# Altium project TM4C123G.PrjPcb (part 1 of 2)
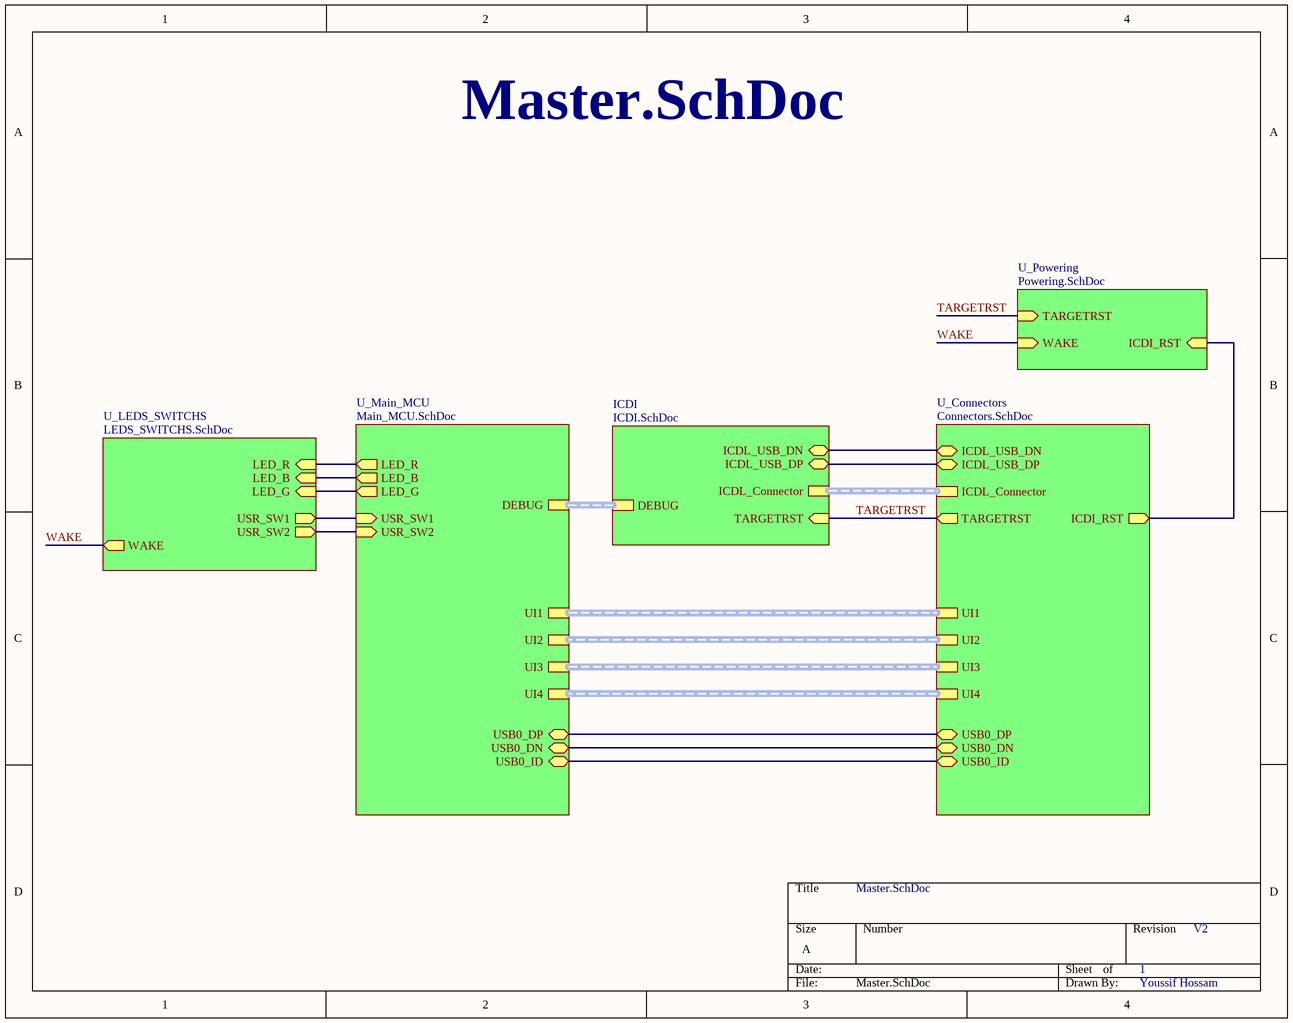
[diagram p0: Master.SchDoc]
Version: V2; Designer: Youssif Hossam
6 sheets, 93 parts. Net scope: hierarchical (ports join the sheet entries above them; power ports are global).
Board file: TM4C123G.PcbDoc
Sheets:
  Master.SchDoc
    U_Main_MCU = Main_MCU.SchDoc
    U_Connectors = Connectors.SchDoc
    ICDI = ICDI.SchDoc
    U_LEDS_SWITCHS = LEDS_SWITCHS.SchDoc
    U_Powering = Powering.SchDoc

## Sheet Master.SchDoc
size A; SheetNumber: 1; SheetTotal: 5

### Sub-sheets
ICDI = ICDI.SchDoc: ICDL_USB_DN (bidir), ICDL_USB_DP (bidir), DEBUG (harness DEBUG), TARGETRST (in), ICDL_Connector (harness ICDL)
U_Connectors = Connectors.SchDoc: USB0_DN (bidir), USB0_DP (bidir), USB0_ID (bidir), ICDL_USB_DN (bidir), ICDL_USB_DP (bidir), ICDL_Connector (harness ICDL), ICDI_RST (out), UI1 (harness UI1), UI2 (harness UI2), UI3 (harness UI3), UI4 (harness UI4), TARGETRST (out)
U_LEDS_SWITCHS = LEDS_SWITCHS.SchDoc: USR_SW2 (out), LED_R (in), LED_B (in), LED_G (in), USR_SW1 (out), WAKE (out)
U_Main_MCU = Main_MCU.SchDoc: USR_SW2 (in), LED_R (out), LED_B (out), LED_G (out), USR_SW1 (in), USB0_DN (bidir), USB0_DP (bidir), USB0_ID (bidir), DEBUG (harness DEBUG), UI1 (harness UI1), UI2 (harness UI2), UI3 (harness UI3), UI4 (harness UI4)
U_Powering = Powering.SchDoc: WAKE (in), TARGETRST (in), ICDI_RST (in)

### Nets
ICDI_RST: sheet U_Connectors/ICDI_RST, sheet U_Powering/ICDI_RST
ICDL_USB_N: sheet U_Connectors/ICDL_USB_DN, sheet ICDI/ICDL_USB_DN
ICDL_USB_P: sheet U_Connectors/ICDL_USB_DP, sheet ICDI/ICDL_USB_DP
LED_B: sheet U_Main_MCU/LED_B, sheet U_LEDS_SWITCHS/LED_B
LED_G: sheet U_Main_MCU/LED_G, sheet U_LEDS_SWITCHS/LED_G
LED_R: sheet U_Main_MCU/LED_R, sheet U_LEDS_SWITCHS/LED_R
TARGETRST: sheet U_Connectors/TARGETRST, sheet ICDI/TARGETRST, sheet U_Powering/TARGETRST
USB0_ID: sheet U_Main_MCU/USB0_ID, sheet U_Connectors/USB0_ID
USB0_N: sheet U_Main_MCU/USB0_DN, sheet U_Connectors/USB0_DN
USB0_P: sheet U_Main_MCU/USB0_DP, sheet U_Connectors/USB0_DP
USR_SW1: sheet U_Main_MCU/USR_SW1, sheet U_LEDS_SWITCHS/USR_SW1
WAKE: sheet U_Main_MCU/USR_SW2, sheet U_LEDS_SWITCHS/USR_SW2, sheet U_LEDS_SWITCHS/WAKE, sheet U_Powering/WAKE  [project net USR_SW2]

### Buses and harness runs
harness sheet ICDI/DEBUG = sheet U_Main_MCU/DEBUG
harness sheet ICDI/ICDL_Connector = sheet U_Connectors/ICDL_Connector
harness sheet U_Connectors/UI1 = sheet U_Main_MCU/UI1
harness sheet U_Connectors/UI2 = sheet U_Main_MCU/UI2
harness sheet U_Connectors/UI3 = sheet U_Main_MCU/UI3
harness sheet U_Connectors/UI4 = sheet U_Main_MCU/UI4

## Sheet Main_MCU.SchDoc
size A; SheetNumber: 2; SheetTotal: 6
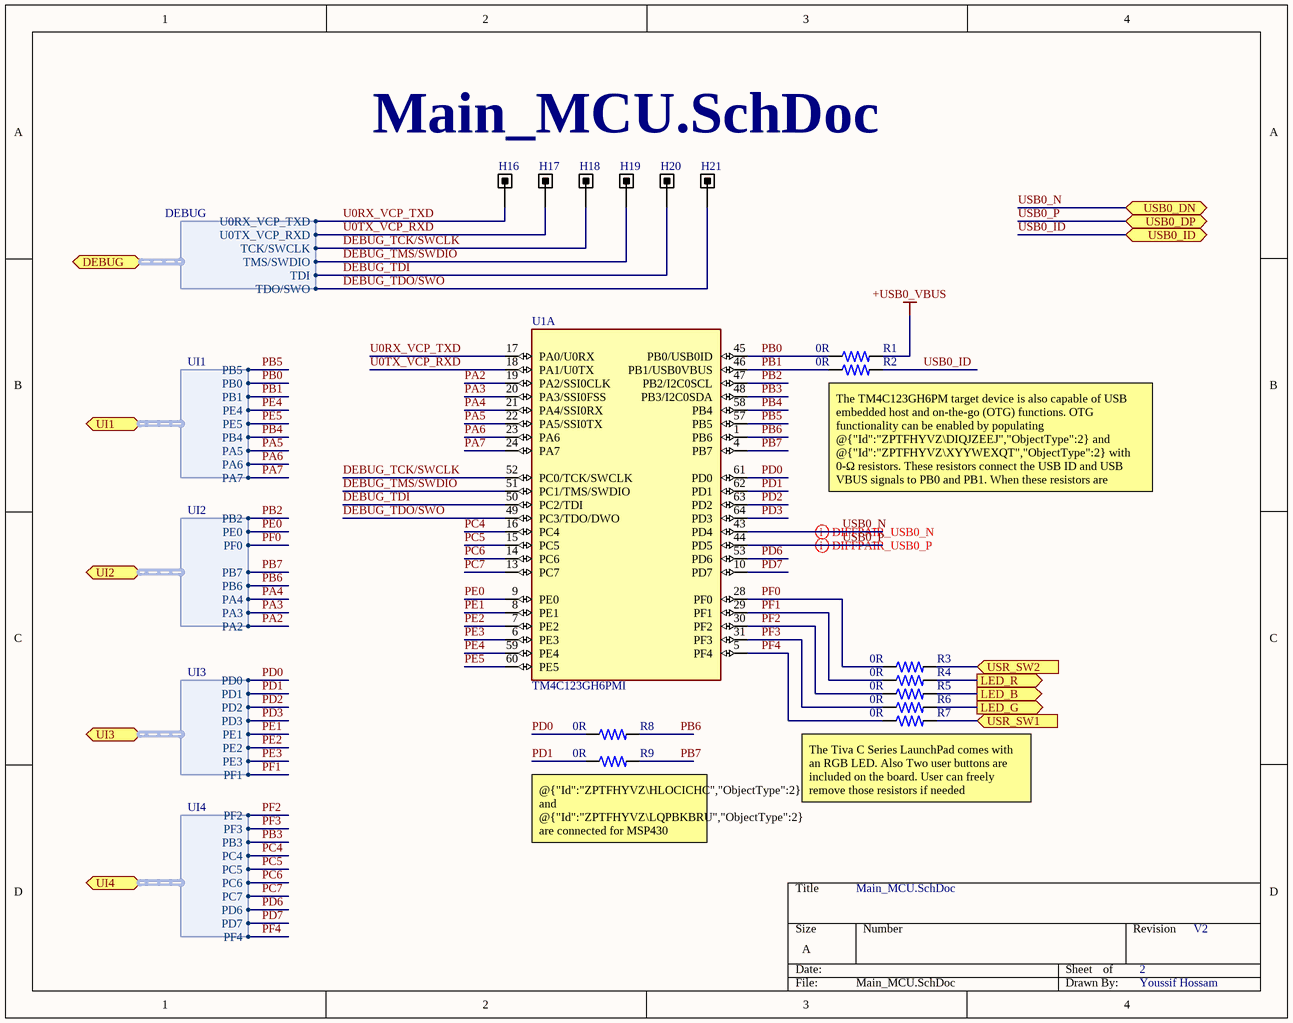
[diagram p1: Main_MCU.SchDoc]

### Parts
H16  Test Point  [Test Point]  (value not drawn)
H17  Test Point  [Test Point]  (value not drawn)
H18  Test Point  [Test Point]  (value not drawn)
H19  Test Point  [Test Point]  (value not drawn)
H20  Test Point  [Test Point]  (value not drawn)
H21  Test Point  [Test Point]  (value not drawn)
R1  0R  [FP-ERA3A-IPC_B]
R2  0R  [FP-ERA3A-IPC_B]
R3  0R  [FP-ERA3A-IPC_B]
R4  0R  [FP-ERA3A-IPC_B]
R5  0R  [FP-ERA3A-IPC_B]
R6  0R  [FP-ERA3A-IPC_B]
R7  0R  [FP-ERA3A-IPC_B]
R8  0R  [0402 RES]
R9  0R  [0402 RES]
U1  TM4C123GH6PMI  [QFP50P1200X1200X160-64N]  (part A of 2)

### Ports
DEBUG (bidir, harness DEBUG, see Master[2B], In-Circuit_Debug_Interface[1B]), LED_B (out, see Master[2B], LEDS_SWITCHS[1A]), LED_G (out, see Master[2B], LEDS_SWITCHS[1B]), LED_R (out, see Master[2B], LEDS_SWITCHS[1A]), UI1 (bidir, harness UI1, see Master[2C], Connectors[1C]), UI2 (bidir, harness UI2, see Master[2C], Connectors[4C]), UI3 (bidir, harness UI3, see Master[2C], Connectors[2D]), UI4 (bidir, harness UI4, see Master[2C], Connectors[3C]), USB0_DN (bidir, see Master[2C], Connectors[1A]), USB0_DP (bidir, see Master[2C], Connectors[1A]), USB0_ID (bidir, see Master[2C], Connectors[1A]), USR_SW1 (in, see Master[2C], LEDS_SWITCHS[4B]), USR_SW2 (in, see Master[2C], LEDS_SWITCHS[4B])

### Harnesses
DEBUG: U0RX_VCP_TXD, U0TX_VCP_RXD, TCK/SWCLK, TMS/SWDIO, TDI, TDO/SWO
UI1: PB5, PB0, PB1, PE4, PE5, PB4, PA5, PA6, PA7
UI2: PB2, PE0, PF0, PB7, PB6, PA4, PA3, PA2
UI3: PD0, PD1, PD2, PD3, PE1, PE2, PE3, PF1
UI4: PF2, PF3, PB3, PC4, PC5, PC6, PC7, PD6, PD7, PF4

### Nets
+USB0_VBUS: R1.2
DEBUG_TCK/SWCLK: H18.1 U1.52(PC0/TCK/SWCLK) ; port DEBUG.TCK/SWCLK
DEBUG_TDI: H20.1 U1.50(PC2/TDI) ; port DEBUG.TDI
DEBUG_TDO/SWO: H21.1 U1.49(PC3/TDO/DWO) ; port DEBUG.TDO/SWO
DEBUG_TMS/SWDIO: H19.1 U1.51(PC1/TMS/SWDIO) ; port DEBUG.TMS/SWDIO
LED_B: R5.2 ; port LED_B
LED_G: R6.2 ; port LED_G
LED_R: R4.2 ; port LED_R
PA2: U1.19(PA2/SSI0CLK) ; port UI2.PA2
PA3: U1.20(PA3/SSI0FSS) ; port UI2.PA3
PA4: U1.21(PA4/SSI0RX) ; port UI2.PA4
PA5: U1.22(PA5/SSI0TX) ; port UI1.PA5
PA6: U1.23(PA6) ; port UI1.PA6
PA7: U1.24(PA7) ; port UI1.PA7
PB0: R1.1 U1.45(PB0/USB0ID) ; port UI1.PB0
PB1: R2.1 U1.46(PB1/USB0VBUS) ; port UI1.PB1
PB2: U1.47(PB2/I2C0SCL) ; port UI2.PB2
PB3: U1.48(PB3/I2C0SDA) ; port UI4.PB3
PB4: U1.58(PB4) ; port UI1.PB4
PB5: U1.57(PB5) ; port UI1.PB5
PB6: R8.2 U1.1(PB6) ; port UI2.PB6
PB7: R9.2 U1.4(PB7) ; port UI2.PB7
PC4: U1.16(PC4) ; port UI4.PC4
PC5: U1.15(PC5) ; port UI4.PC5
PC6: U1.14(PC6) ; port UI4.PC6
PC7: U1.13(PC7) ; port UI4.PC7
PD0: R8.1 U1.61(PD0) ; port UI3.PD0
PD1: R9.1 U1.62(PD1) ; port UI3.PD1
PD2: U1.63(PD2) ; port UI3.PD2
PD3: U1.64(PD3) ; port UI3.PD3
PD6: U1.53(PD6) ; port UI4.PD6
PD7: U1.10(PD7) ; port UI4.PD7
PE0: U1.9(PE0) ; port UI2.PE0
PE1: U1.8(PE1) ; port UI3.PE1
PE2: U1.7(PE2) ; port UI3.PE2
PE3: U1.6(PE3) ; port UI3.PE3
PE4: U1.59(PE4) ; port UI1.PE4
PE5: U1.60(PE5) ; port UI1.PE5
PF0: R3.1 U1.28(PF0) ; port UI2.PF0
PF1: R4.1 U1.29(PF1) ; port UI3.PF1
PF2: R5.1 U1.30(PF2) ; port UI4.PF2
PF3: R6.1 U1.31(PF3) ; port UI4.PF3
PF4: R7.1 U1.5(PF4) ; port UI4.PF4
U0RX_VCP_TXD: H16.1 U1.17(PA0/U0RX) ; port DEBUG.U0RX_VCP_TXD
U0TX_VCP_RXD: H17.1 U1.18(PA1/U0TX) ; port DEBUG.U0TX_VCP_RXD
USB0_ID: R2.2 ; port USB0_ID
USB0_N: U1.43(PD4) ; port USB0_DN
USB0_P: U1.44(PD5) ; port USB0_DP
USR_SW1: R7.2 ; port USR_SW1
USR_SW2: R3.2 ; port USR_SW2

### Layout directives
differential pair; differential pair class USB: USB0_N, USB0_P

### Notes on the sheet
- (near R2) The TM4C123GH6PM target device is also capable of USB embedded host and on-the-go (OTG) functions. OTG functionality can be enabled by populating @{"Id":"ZPTFHYVZ\DIQJZEEJ","ObjectType":2} and @{"Id":"ZPTFHYVZ\XYYWEXQT","ObjectType":2} with 0-Ω resistors. These resistors connect the USB ID and USB VBUS signals to PB0 and PB1. When these resistors are populated, PB0 and PB1 must remain in the respective USB pin mode configurations to prevent device damage.
- (near R9) @{"Id":"ZPTFHYVZ\HLOCICHC","ObjectType":2} and @{"Id":"ZPTFHYVZ\LQPBKBRU","ObjectType":2} are connected for MSP430 BoosterPack Interface Compatability. User can remove them if needed
- (near R7) The Tiva C Series LaunchPad comes with an RGB LED. Also Two user buttons are included on the board. User can freely remove those resistors if needed

### Library data of the parts
R1-R7 = 0603 SMD RES: Fixed Resistor, Metal Glaze/thick Film, 0.1W, 0ohm, Surface Mount, 0603; Manufacturer: Panasonic; Manufacturer Part Number: ERJ-3GEY0R00V; Power: 100mW; Rated Temperature: 70°C; Package Height: 0.45mm; Package Length: 1.6mm; Package Width: 0.8mm; Reference Standard: AEC-Q200; Supplier: Mouser; Supplier Part Number: 667-ERJ-3GEY0R00V; RoHS: Yes; Category: Chip SMD Resistors; Stock: 3258844; Pricing: 1=0.1, 10=0.022, 50=0.022, 100=0.01, 1000=0.008, 10000=0.004 (USD); Mounting Technology: Surface Mount; Pins: 2; Package Shape: Rectangular; Case/Package: 0603; Terminal Finish: Nickel; Min Operating Temperature: -55°C; Max Operating Temperature: 155°C; JESD-609 Code: e3; Resistor Type: FIXED RESISTOR; Construction: Rectangular; Packaging: Tape and Reel; Value: 0R; Technology: METAL GLAZE/THICK FILM; Termination: Wraparound; Reach SVHC Compliant: Yes; RoHS Compliant: Yes; ComponentLink1URL: https://datasheet.ciiva.com:443/pdfs/VipMasterIC/IC/PANA/PANA-S-A0009459603/PANA-S-A0009459603-1.pdf?src-supplier=IHS+Markit; ComponentLink1Description: https://datasheet.ciiva.com:443/pdfs/VipMasterIC/IC/PANA/PANA-S-A0009459603/PANA-S-A0009459603-1.pdf?src-supplier=IHS+Markit; ComponentLink2URL: https://datasheet.ciiva.com/27055/1935748-27055113.pdf?src-supplier=Jameco; ComponentLink2Description: https://datasheet.ciiva.com/27055/1935748-27055113.pdf?src-supplier=Jameco; ComponentLink3URL: https://datasheet.ciiva.com/11808/0900766b80f806dd-11808207.pdf?src-supplier=Rs; ComponentLink3Description: https://datasheet.ciiva.com/11808/0900766b80f806dd-11808207.pdf?src-supplier=Rs; ComponentLink4URL: https://datasheet.ciiva.com/46377/1678796-46377868.pdf?src-supplier=Element14; ComponentLink4Description: https://datasheet.ciiva.com/46377/1678796-46377868.pdf?src-supplier=Element14; ComponentLink5URL: https://datasheet.ciiva.com/9198/aoa0000ce1-9198975.pdf?src-supplier=Avnet; ComponentLink5Description: https://datasheet.ciiva.com/9198/aoa0000ce1-9198975.pdf?src-supplier=Avnet; ComponentLink6URL: https://datasheet.ciiva.com/16834/aoa0000ce1-16834828.pdf?src-supplier=Future+Electronics; ComponentLink6Description: https://datasheet.ciiva.com/16834/aoa0000ce1-16834828.pdf?src-supplier=Future+Electronics; ComponentLink7URL: https://datasheet.ciiva.com/30199/4aoa0000ce1-30199822.pdf?src-supplier=Onlinecomponents.com; ComponentLink7Description: https://datasheet.ciiva.com/30199/4aoa0000ce1-30199822.pdf?src-supplier=Onlinecomponents.com; ComponentLink8URL: https://datasheet.ciiva.com/43460/1678796-43460647.pdf?src-supplier=Farnell; ComponentLink8Description: https://datasheet.ciiva.com/43460/1678796-43460647.pdf?src-supplier=Farnell; ComponentLink9URL: https://datasheet.ciiva.com/5959/1678796-5959707.pdf?src-supplier=Farnell; ComponentLink9Description: https://datasheet.ciiva.com/5959/1678796-5959707.pdf?src-supplier=Farnell; ComponentLink10URL: https://datasheet.ciiva.com/28695/1678796-28695833.pdf?src-supplier=Element14; ComponentLink10Description: https://datasheet.ciiva.com/28695/1678796-28695833.pdf?src-supplier=Element14; ComponentLink11URL: https://datasheet.ciiva.com/16758/70255313-16758527.pdf?src-supplier=Allied+Electronics; ComponentLink11Description: https://datasheet.ciiva.com/16758/70255313-16758527.pdf?src-supplier=Allied+Electronics; ComponentLink12URL: https://datasheet.ciiva.com/48532/aoa0000ce1-48532165.pdf?src-supplier=Avnet; ComponentLink12Description: https://datasheet.ciiva.com/48532/aoa0000ce1-48532165.pdf?src-supplier=Avnet
R8 R9 = 0402 SMD Resistor: Metal Glaze/thick Film, 0.0625W, 0ohm, Surface Mount, 0402; Manufacturer: Yageo; Manufacturer Part Number: RC0402JR-070RL; Power: 62.5mW; Rated Temperature: 70°C; Package Height: 0.35mm; Package Length: 1mm; Package Width: 0.5mm; ComponentLink1Description: Link; ComponentLink1URL: *; Supplier: Future Electronics; Supplier Part Number: 3375797; RoHS: Yes; Category: Chip SMD Resistors; Stock: 16470000; Pricing: 10000=0.0011, 50000=0.0011, 250000=0.001, 500000=0.001, 1500000=0.0009 (USD); Mounting Technology: Surface Mount; Pins: 2; Package Shape: Rectangular; Case/Package: 0402; Terminal Finish: Nickel; Min Operating Temperature: -55°C; Max Operating Temperature: 155°C; JESD-609 Code: e3; Resistor Type: FIXED RESISTOR; Packaging: Tape and Reel; Value: 0R; Technology: METAL GLAZE/THICK FILM; Termination: Wraparound; Construction: Chip; Reach SVHC Compliant: Yes; RoHS Compliant: Yes; ComponentLink2URL: https://datasheet.ciiva.com:443/pdfs/VipMasterIC/IC/YAGO/YAGO-S-A0008145938/YAGO-S-A0008145938-1.pdf?src-supplier=IHS+Markit; ComponentLink2Description: https://datasheet.ciiva.com:443/pdfs/VipMasterIC/IC/YAGO/YAGO-S-A0008145938/YAGO-S-A0008145938-1.pdf?src-supplier=IHS+Markit
U1 = TM4C123GH6PMI: ARMÂ® CortexÂ®-M4F Tivaâ„¢ C Microcontroller IC 32-Bit 80MHz 256KB _256K x 8_ FLASH 64-LQFP _10x10_; MF: Texas Instruments; Price: None; Availability: Unavailable; SnapEDA_Link: https://www.snapeda.com/parts/TM4C123GH6PMI/Texas%20Instruments/view-part/557012/?ref=snap; Value: *; Package: LQFP-64 Texas Instruments; MP: TM4C123GH6PMI

## Sheet Connectors.SchDoc
size B; SheetNumber: 4; SheetTotal: 6
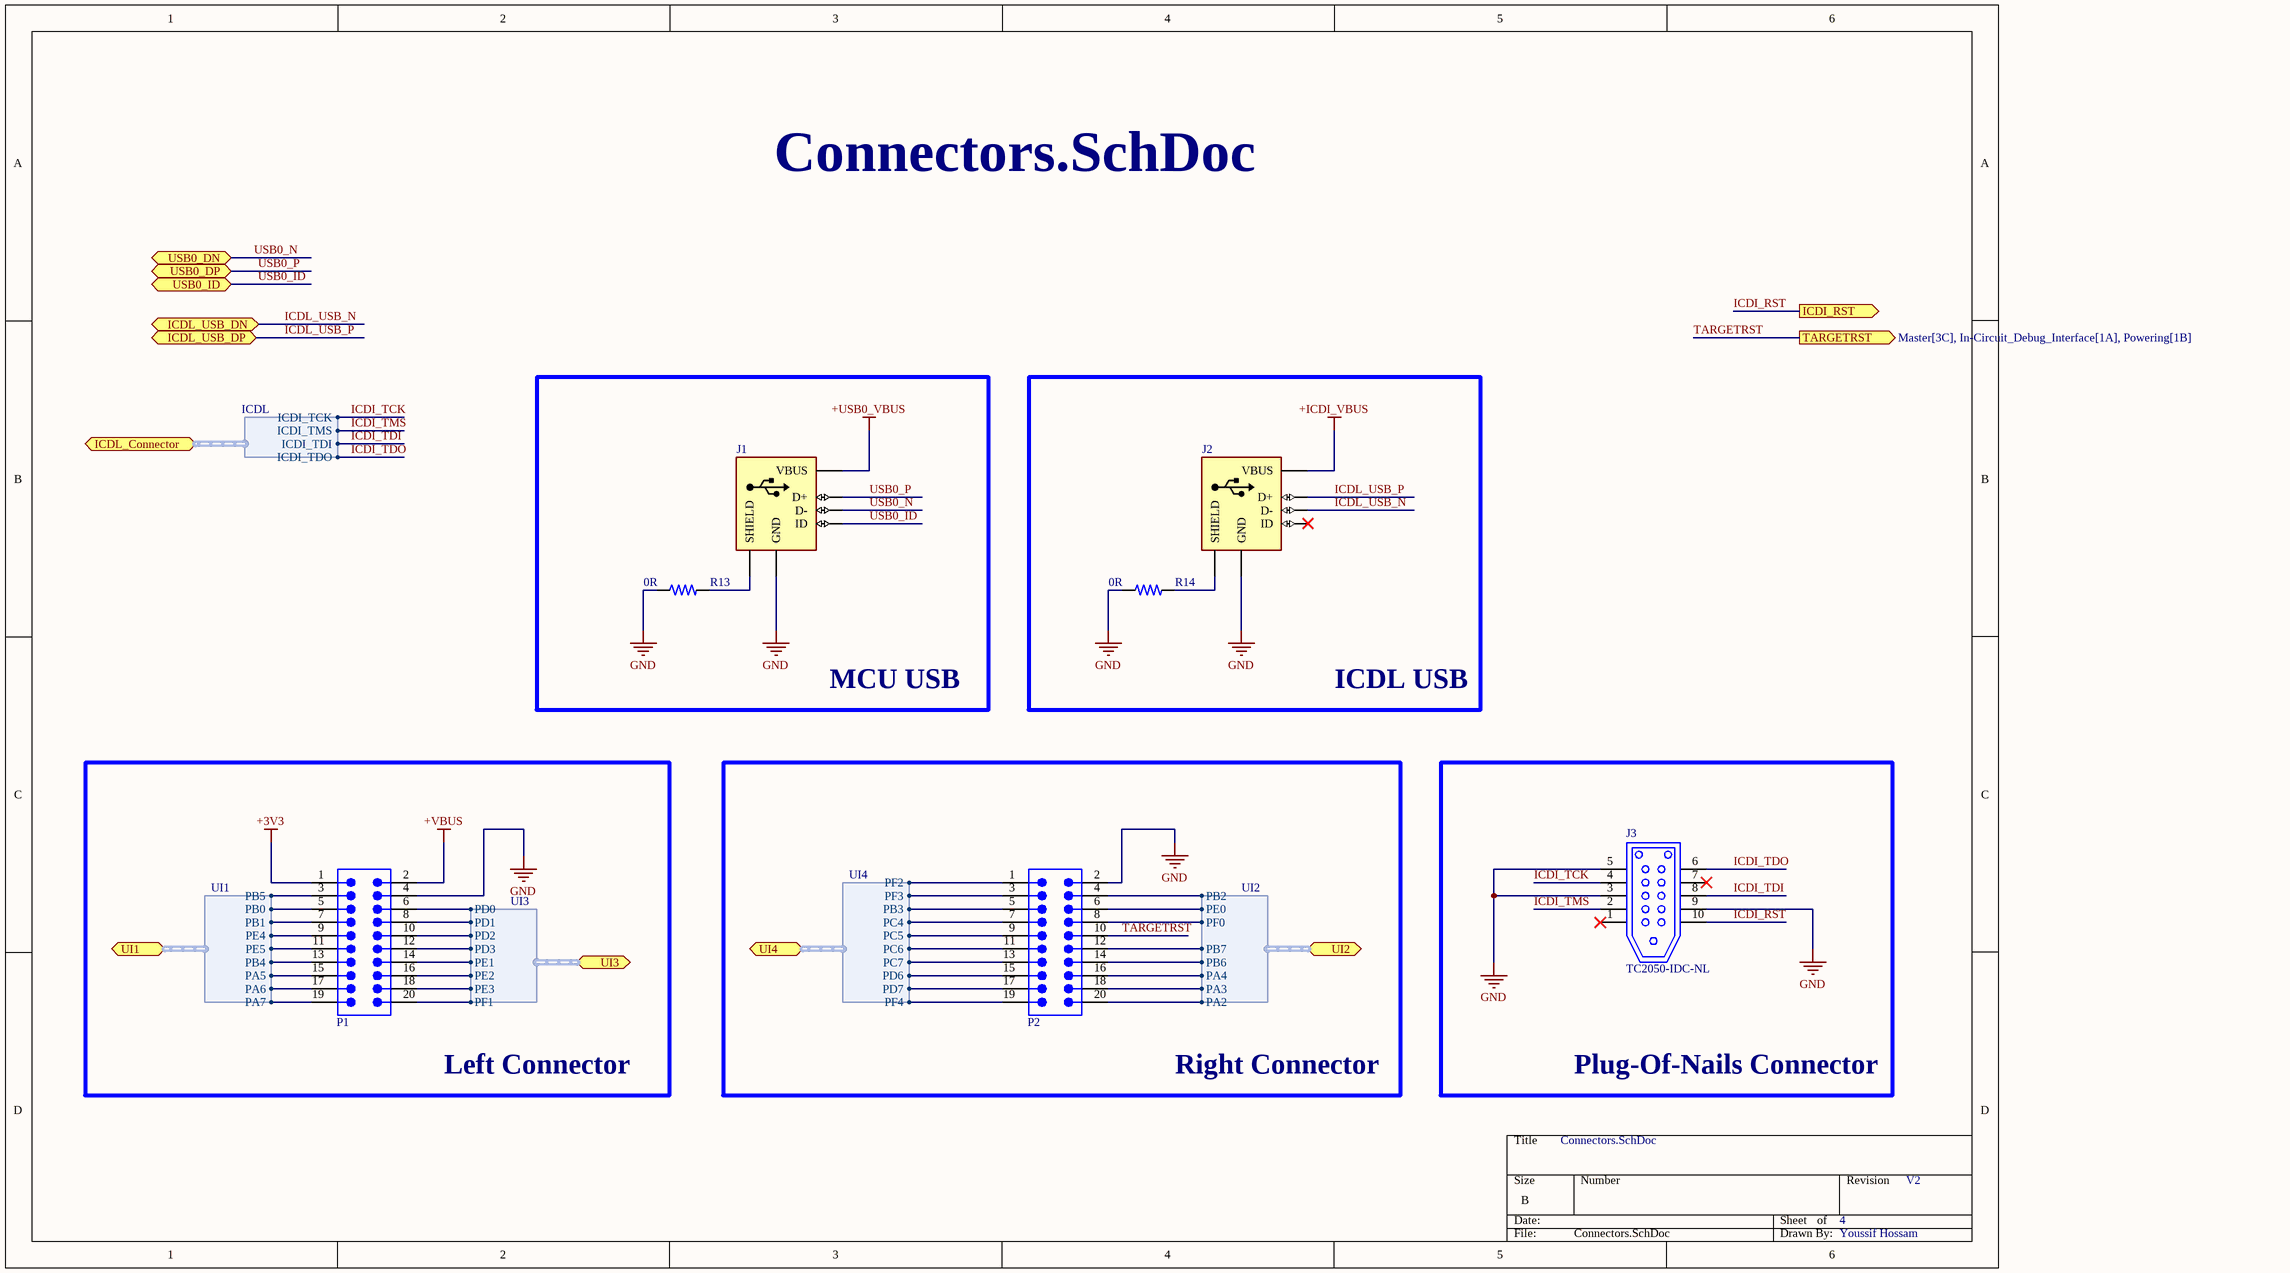
[diagram p2: Connectors.SchDoc]

### Parts
J1  USB3085-XX-X_REVD  [GCT_USB3085-XX-X_REVD]  (value not drawn)
J2  USB3085-XX-X_REVD  [GCT_USB3085-XX-X_REVD]  (value not drawn)
J3  TC2050-IDC-NL  [TAG-CONNECT_TC2050-IDC-NL]
P1  61302021121  [61302021121]  (value not drawn)
P2  61302021121  [61302021121]  (value not drawn)
R13  0R  [FP-ERA3A-IPC_B]
R14  0R  [FP-ERA3A-IPC_B]

### Blocks framed on the sheet
MCU USB: J1 R13
ICDL USB: J2 R14
Left Connector: P1
Right Connector: P2
Plug-Of-Nails Connector: J3

### Ports
ICDI_RST (out, see Master[4C], Powering[1A]), ICDL_Connector (bidir, harness ICDL, see Master[3B], In-Circuit_Debug_Interface[1C]), ICDL_USB_DN (bidir, see Master[3B], In-Circuit_Debug_Interface[1A]), ICDL_USB_DP (bidir, see Master[3B], In-Circuit_Debug_Interface[1A]), TARGETRST (out, see Master[3C], In-Circuit_Debug_Interface[1A], Powering[1B]), UI1 (bidir, harness UI1, see Master[3C], Main_MCU[1B]), UI2 (bidir, harness UI2, see Master[3C], Main_MCU[1C]), UI3 (bidir, harness UI3, see Master[3C], Main_MCU[1C]), UI4 (bidir, harness UI4, see Master[3C], Main_MCU[1D]), USB0_DN (bidir, see Master[3C], Main_MCU[4A]), USB0_DP (bidir, see Master[3C], Main_MCU[4A]), USB0_ID (bidir, see Master[3C], Main_MCU[4A])

### Harnesses
ICDL: ICDI_TCK, ICDI_TMS, ICDI_TDI, ICDI_TDO
UI1: PB5, PB0, PB1, PE4, PE5, PB4, PA5, PA6, PA7
UI2: PB2, PE0, PF0, PB7, PB6, PA4, PA3, PA2
UI3: PD0, PD1, PD2, PD3, PE1, PE2, PE3, PF1
UI4: PF2, PF3, PB3, PC4, PC5, PC6, PC7, PD6, PD7, PF4

### Nets
+3V3: P1.1
+ICDI_VBUS: J2.1(VBUS)
+USB0_VBUS: J1.1(VBUS)
+VBUS: P1.2
GND: J1.5(GND) J2.5(GND) J3.3 J3.5 J3.9 P1.4 P2.2 R13.1 R14.1
ICDI_RST: J3.10 ; port ICDI_RST
ICDI_TCK: J3.4 ; port ICDL_Connector.ICDI_TCK
ICDI_TDI: J3.8 ; port ICDL_Connector.ICDI_TDI
ICDI_TDO: J3.6 ; port ICDL_Connector.ICDI_TDO
ICDI_TMS: J3.2 ; port ICDL_Connector.ICDI_TMS
ICDL_USB_N: J2.2(D-) ; port ICDL_USB_DN
ICDL_USB_P: J2.3(D+) ; port ICDL_USB_DP
PA2: P2.20 ; port UI2.PA2
PA3: P2.18 ; port UI2.PA3
PA4: P2.16 ; port UI2.PA4
PA5: P1.15 ; port UI1.PA5
PA6: P1.17 ; port UI1.PA6
PA7: P1.19 ; port UI1.PA7
PB0: P1.5 ; port UI1.PB0
PB1: P1.7 ; port UI1.PB1
PB2: P2.4 ; port UI2.PB2
PB3: P2.5 ; port UI4.PB3
PB4: P1.13 ; port UI1.PB4
PB5: P1.3 ; port UI1.PB5
PB6: P2.14 ; port UI2.PB6
PB7: P2.12 ; port UI2.PB7
PC4: P2.7 ; port UI4.PC4
PC5: P2.9 ; port UI4.PC5
PC6: P2.11 ; port UI4.PC6
PC7: P2.13 ; port UI4.PC7
PD0: P1.6 ; port UI3.PD0
PD1: P1.8 ; port UI3.PD1
PD2: P1.10 ; port UI3.PD2
PD3: P1.12 ; port UI3.PD3
PD6: P2.15 ; port UI4.PD6
PD7: P2.17 ; port UI4.PD7
PE0: P2.6 ; port UI2.PE0
PE1: P1.14 ; port UI3.PE1
PE2: P1.16 ; port UI3.PE2
PE3: P1.18 ; port UI3.PE3
PE4: P1.9 ; port UI1.PE4
PE5: P1.11 ; port UI1.PE5
PF0: P2.8 ; port UI2.PF0
PF1: P1.20 ; port UI3.PF1
PF2: P2.1 ; port UI4.PF2
PF3: P2.3 ; port UI4.PF3
PF4: P2.19 ; port UI4.PF4
TARGETRST: P2.10 ; port TARGETRST
USB0_ID: J1.4(ID) ; port USB0_ID
USB0_N: J1.2(D-) ; port USB0_DN
USB0_P: J1.3(D+) ; port USB0_DP
NetJ1_SH: J1.SH(SHIELD) R13.2
NetJ2_SH: J2.SH(SHIELD) R14.2

Not connected (* = marked no-connect by the designer): J2 4(ID)*; J3 1* 7*

### Library data of the parts
J1 J2 = USB3085-XX-X_REVD: USB - micro AB USB 2.0 Receptacle Connector 5 Position Surface Mount, Right Angle; pin to pad: SH>6+7+8+9; MF: Global Connector Technology; MP: USB3085-30-A; SnapEDA_Link: https://www.snapeda.com/parts/USB3085-30-A/Global%20Connector%20Technology/view-part/446505/?ref=snap; Price: None; Value: *; Availability: Unavailable; Package: None
J3 = TC2050-IDC-NL: MSP-FET430 Flash Emulation Tool Plug-Of-Nailsâ„¢ Adapter Cable; MF: Tag-Connect LLC; Price: None; Availability: In Stock; MP: TC2050-IDC-NL; Package: None; SnapEDA_Link: https://www.snapeda.com/parts/TC2050-IDC-NL/Tag-Connect+LLC/view-part/?ref=snap; Check_prices: https://www.snapeda.com/parts/TC2050-IDC-NL/Tag-Connect+LLC/view-part/?ref=eda; Value: *; Purchase-URL: https://pricing.snapeda.com/search/part/TC2050-IDC-NL/?ref=eda
P1 P2 = 61302021121: WR-PHD Pin Header, THT, Vertical, pitch 2.54mm, 2 Row, 20P; Manufacturer: Wurth Elektronik; Contact Resistance: 20mOhm; Rated Current: 3A; Working Voltage: 250V; Withstanding Voltage: 500V; Manufacturer Part Number: 61302021121; Category: Board-to-Board Connectors; Match Code: WR-PHD; ComponentLink1Description: Website Link; ComponentLink1URL: https://www.we-online.com/redexpert/article/61302021121?ad; ComponentLink2Description: Datasheet Link; ComponentLink2URL: https://www.we-online.com/redexpert/spec/61302021121?ad; Mount: Through Hole; Operating Temperature Max: 105°C; Operating Temperature Min: -40°C; Packaging: Bag; Gender: Pin Header; Number of Pins: 20; Number of Rows: 2; Orientation: Vertical; Pitch: 2.54mm
R13 R14 = 0603 SMD RES: as R1 on sheet Main_MCU; Supplier: Mouser; Supplier Part Number: 667-ERJ-3GEY0R00V; RoHS: Yes; Category: Chip SMD Resistors; Stock: 3258844; Pricing: 1=0.1, 10=0.022, 50=0.022, 100=0.01, 1000=0.008, 10000=0.004 (USD); Mounting Technology: Surface Mount; Pins: 2; Package Shape: Rectangular; Case/Package: 0603; Terminal Finish: Nickel; Min Operating Temperature: -55°C; Max Operating Temperature: 155°C; JESD-609 Code: e3; Resistor Type: FIXED RESISTOR; Construction: Rectangular; Packaging: Tape and Reel; Value: 0R; Technology: METAL GLAZE/THICK FILM; Termination: Wraparound; Reach SVHC Compliant: Yes; RoHS Compliant: Yes; ComponentLink1URL: https://datasheet.ciiva.com:443/pdfs/VipMasterIC/IC/PANA/PANA-S-A0009459603/PANA-S-A0009459603-1.pdf?src-supplier=IHS+Markit; ComponentLink1Description: https://datasheet.ciiva.com:443/pdfs/VipMasterIC/IC/PANA/PANA-S-A0009459603/PANA-S-A0009459603-1.pdf?src-supplier=IHS+Markit; ComponentLink2URL: https://datasheet.ciiva.com/27055/1935748-27055113.pdf?src-supplier=Jameco; ComponentLink2Description: https://datasheet.ciiva.com/27055/1935748-27055113.pdf?src-supplier=Jameco; ComponentLink3URL: https://datasheet.ciiva.com/11808/0900766b80f806dd-11808207.pdf?src-supplier=Rs; ComponentLink3Description: https://datasheet.ciiva.com/11808/0900766b80f806dd-11808207.pdf?src-supplier=Rs; ComponentLink4URL: https://datasheet.ciiva.com/46377/1678796-46377868.pdf?src-supplier=Element14; ComponentLink4Description: https://datasheet.ciiva.com/46377/1678796-46377868.pdf?src-supplier=Element14; ComponentLink5URL: https://datasheet.ciiva.com/9198/aoa0000ce1-9198975.pdf?src-supplier=Avnet; ComponentLink5Description: https://datasheet.ciiva.com/9198/aoa0000ce1-9198975.pdf?src-supplier=Avnet; ComponentLink6URL: https://datasheet.ciiva.com/16834/aoa0000ce1-16834828.pdf?src-supplier=Future+Electronics; ComponentLink6Description: https://datasheet.ciiva.com/16834/aoa0000ce1-16834828.pdf?src-supplier=Future+Electronics; ComponentLink7URL: https://datasheet.ciiva.com/30199/4aoa0000ce1-30199822.pdf?src-supplier=Onlinecomponents.com; ComponentLink7Description: https://datasheet.ciiva.com/30199/4aoa0000ce1-30199822.pdf?src-supplier=Onlinecomponents.com; ComponentLink8URL: https://datasheet.ciiva.com/43460/1678796-43460647.pdf?src-supplier=Farnell; ComponentLink8Description: https://datasheet.ciiva.com/43460/1678796-43460647.pdf?src-supplier=Farnell; ComponentLink9URL: https://datasheet.ciiva.com/5959/1678796-5959707.pdf?src-supplier=Farnell; ComponentLink9Description: https://datasheet.ciiva.com/5959/1678796-5959707.pdf?src-supplier=Farnell; ComponentLink10URL: https://datasheet.ciiva.com/28695/1678796-28695833.pdf?src-supplier=Element14; ComponentLink10Description: https://datasheet.ciiva.com/28695/1678796-28695833.pdf?src-supplier=Element14; ComponentLink11URL: https://datasheet.ciiva.com/16758/70255313-16758527.pdf?src-supplier=Allied+Electronics; ComponentLink11Description: https://datasheet.ciiva.com/16758/70255313-16758527.pdf?src-supplier=Allied+Electronics; ComponentLink12URL: https://datasheet.ciiva.com/48532/aoa0000ce1-48532165.pdf?src-supplier=Avnet; ComponentLink12Description: https://datasheet.ciiva.com/48532/aoa0000ce1-48532165.pdf?src-supplier=Avnet

## Sheet ICDI.SchDoc
size A; SheetNumber: 6; SheetTotal: 6
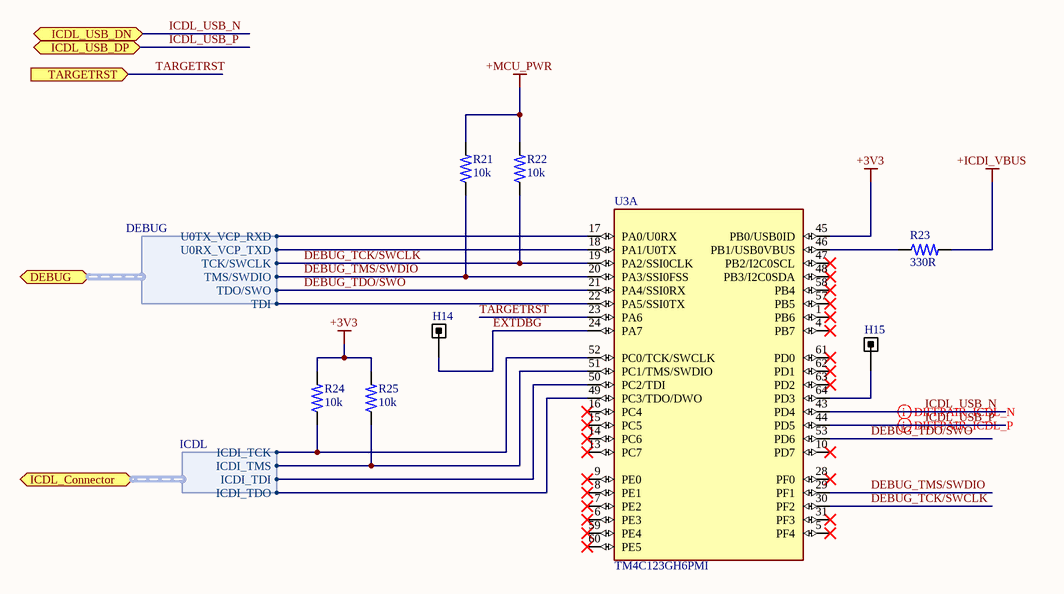
[diagram p3: ICDI.SchDoc]

### Parts
H14  Test Point  [Test Point]  (value not drawn)
H15  Test Point  [Test Point]  (value not drawn)
R21  10k  [0402 RES]
R22  10k  [0402 RES]
R23  330R  [0402 RES]
R24  10k  [0402 RES]
R25  10k  [0402 RES]
U3  TM4C123GH6PMI  [QFP50P1200X1200X160-64N]  (part A of 2)

### Ports
DEBUG (bidir, harness DEBUG, see Master[2B], Main_MCU[1B]), ICDL_Connector (bidir, harness ICDL, see Master[3B], Connectors[1B]), ICDL_USB_DN (bidir, see Master[3B], Connectors[1B]), ICDL_USB_DP (bidir, see Master[3B], Connectors[1B]), TARGETRST (in, see Master[3C], Connectors[6B], Powering[1B])

### Harnesses
DEBUG: U0RX_VCP_TXD, U0TX_VCP_RXD, TCK/SWCLK, TMS/SWDIO, TDI, TDO/SWO
ICDL: ICDI_TCK, ICDI_TMS, ICDI_TDI, ICDI_TDO

### Nets
+3V3: R24.2 R25.2 U3.45(PB0/USB0ID)
+ICDI_VBUS: R23.2
+MCU_PWR: R21.2 R22.2
DEBUG_TCK/SWCLK: R22.1 U3.19(PA2/SSI0CLK) U3.30(PF2) ; port DEBUG.TCK/SWCLK
DEBUG_TDI: U3.22(PA5/SSI0TX) ; port DEBUG.TDI
DEBUG_TDO/SWO: U3.21(PA4/SSI0RX) U3.53(PD6) ; port DEBUG.TDO/SWO
DEBUG_TMS/SWDIO: R21.1 U3.20(PA3/SSI0FSS) U3.29(PF1) ; port DEBUG.TMS/SWDIO
EXTDBG: H14.1 U3.24(PA7)
ICDI_TCK: R24.1 U3.52(PC0/TCK/SWCLK) ; port ICDL_Connector.ICDI_TCK
ICDI_TDI: U3.50(PC2/TDI) ; port ICDL_Connector.ICDI_TDI
ICDI_TDO: U3.49(PC3/TDO/DWO) ; port ICDL_Connector.ICDI_TDO
ICDI_TMS: R25.1 U3.51(PC1/TMS/SWDIO) ; port ICDL_Connector.ICDI_TMS
ICDL_USB_N: U3.43(PD4) ; port ICDL_USB_DN
ICDL_USB_P: U3.44(PD5) ; port ICDL_USB_DP
TARGETRST: U3.23(PA6) ; port TARGETRST
U0RX_VCP_TXD: U3.18(PA1/U0TX) ; port DEBUG.U0RX_VCP_TXD
U0TX_VCP_RXD: U3.17(PA0/U0RX) ; port DEBUG.U0TX_VCP_RXD
NetH15_1: H15.1 U3.64(PD3)
NetR23_1: R23.1 U3.46(PB1/USB0VBUS)

Not connected (* = marked no-connect by the designer): U3 1(PB6)* 4(PB7)* 5(PF4)* 6(PE3)* 7(PE2)* 8(PE1)* 9(PE0)* 10(PD7)* 13(PC7)* 14(PC6)* 15(PC5)* 16(PC4)* 28(PF0)* 31(PF3)* 47(PB2/I2C0SCL)* 48(PB3/I2C0SDA)* 57(PB5)* 58(PB4)* 59(PE4)* 60(PE5)* 61(PD0)* 62(PD1)* 63(PD2)*

### Layout directives
differential pair; differential pair class USB: ICDL_USB_N, ICDL_USB_P

### Library data of the parts
R21 R22 R24 R25 = 0402 SMD Resistor: Fixed Resistor, Metal Glaze/thick Film, 0.0625W, 10000ohm, 50V, 1% +/-Tol, 100ppm/Cel, Surface Mount, 0402; Manufacturer: Yageo; Manufacturer Part Number: RC0402FR-0710KL; Additional Feature: LASER TRIMMABLE; Power: 62.5mW; Rated Temperature: 70°C; Value: 10kR; Temperature Coefficient: 100ppm/°C; Package Height: 0.35mm; Package Length: 1mm; Package Width: 0.5mm; ComponentLink1Description: Link; ComponentLink1URL: *; Supplier: Future Electronics; Supplier Part Number: 3388022; RoHS: Yes; Category: Chip SMD Resistors; Stock: 31210000; Pricing: 10000=0.0016, 100000=0.0015, 300000=0.0015, 1250000=0.0014, 3000000=0.0013 (USD); Mounting Technology: Surface Mount; Pins: 2; Package Shape: Rectangular; Case/Package: 0402; Terminal Finish: Nickel; Min Operating Temperature: -55°C; Max Operating Temperature: 155°C; JESD-609 Code: e3; Termination: Wraparound; Resistor Type: FIXED RESISTOR; Construction: Chip; Packaging: Tape and Reel; Technology: METAL GLAZE/THICK FILM; Working Voltage: 50V; Reach SVHC Compliant: Yes; RoHS Compliant: Yes; ComponentLink2URL: https://datasheet.ciiva.com:443/pdfs/VipMasterIC/IC/YAGO/YAGO-S-A0008145938/YAGO-S-A0008145938-1.pdf?src-supplier=IHS+Markit; ComponentLink2Description: https://datasheet.ciiva.com:443/pdfs/VipMasterIC/IC/YAGO/YAGO-S-A0008145938/YAGO-S-A0008145938-1.pdf?src-supplier=IHS+Markit
R23 = 0402 SMD Resistor: Fixed Resistor, Metal Glaze/thick Film, 0.125W, 330ohm, 75V, 1% +/-Tol, 100ppm/Cel, Surface Mount, 0402; Manufacturer: Vishay Dale; Manufacturer Part Number: RCC0402330RFKED; ComponentLink1Description: Link; ComponentLink1URL: *; Supplier: Digikey; Supplier Part Number: 541-RCC0402330RFKEDCT-ND; RoHS: Yes; Category: Chip SMD Resistors; Stock: 92625; Pricing: 1=0.1, 10=0.046, 50=0.0296, 100=0.0248, 500=0.01724, 1000=0.01499, 5000=0.0113 (USD)
U3 = TM4C123GH6PMI: as U1 on sheet Main_MCU; Price: None; Availability: Unavailable; SnapEDA_Link: https://www.snapeda.com/parts/TM4C123GH6PMI/Texas%20Instruments/view-part/557012/?ref=snap; Value: *; Package: LQFP-64 Texas Instruments; MP: TM4C123GH6PMI

## Sheet LEDS_SWITCHS.SchDoc
size A; SheetNumber: 3; SheetTotal: 6
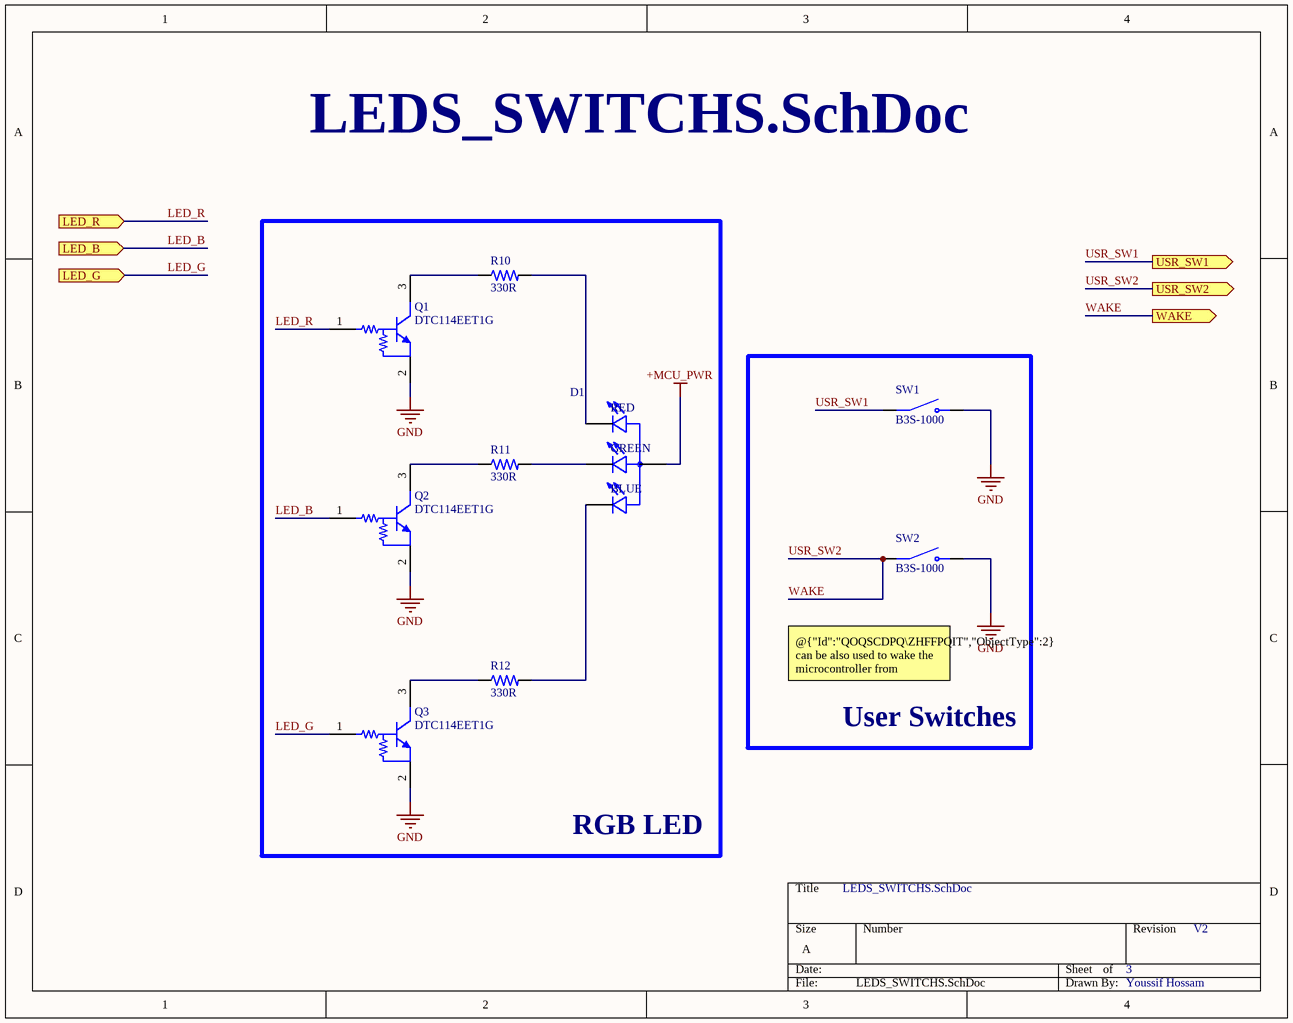
[diagram p4: LEDS_SWITCHS.SchDoc]

### Parts
D1  CLMVC-FKA-CL1D1L71BB7C3C3  [LED_CLMVC-FKA-CL1D1L71BB7C3C3]  (value not drawn)
Q1  DTC114EET1G  [ONSC-SC-75-3-463-01_V]
Q2  DTC114EET1G  [ONSC-SC-75-3-463-01_V]
Q3  DTC114EET1G  [ONSC-SC-75-3-463-01_V]
R10  330R  [0402 RES]
R11  330R  [0402 RES]
R12  330R  [0402 RES]
SW1  B3S-1000  [SW_B3S-1000]
SW2  B3S-1000  [SW_B3S-1000]

### Blocks framed on the sheet
RGB LED: D1 Q1-Q3 R10-R12
User Switches: SW1 SW2

### Ports
LED_B (in, see Master[1B], Main_MCU[4C]), LED_G (in, see Master[1B], Main_MCU[4C]), LED_R (in, see Master[1B], Main_MCU[4C]), USR_SW1 (out, see Master[1C], Main_MCU[4C]), USR_SW2 (out, see Master[1C], Main_MCU[4C]), WAKE (out, see Master[1C], Powering[1A])

### Nets
+MCU_PWR: D1.1(A)
GND: Q1.2(E) Q2.2(E) Q3.2(E) SW1.4(NO) SW2.4(NO)
LED_B: Q2.1(B) ; port LED_B
LED_G: Q3.1(B) ; port LED_G
LED_R: Q1.1(B) ; port LED_R
USR_SW1: SW1.2(COM) ; port USR_SW1
USR_SW2: SW2.2(COM) ; port USR_SW2, port WAKE  [also labelled WAKE]
NetD1_2: D1.2(B_C) R12.2
NetD1_3: D1.3(G_C) R11.2
NetD1_4: D1.4(R_C) R10.2
NetQ1_3: Q1.3(C) R10.1
NetQ2_3: Q2.3(C) R11.1
NetQ3_3: Q3.3(C) R12.1

### Notes on the sheet
- @{"Id":"QOQSCDPQ\ZHFFPQIT","ObjectType":2} can be also used to wake the microcontroller from hibernate mode
- (in symbol CLMVC-FKA-CL1D1L71BB7C3C3) RED; GREEN; BLUE

### Library data of the parts
D1 = CLMVC-FKA-CL1D1L71BB7C3C3: MF: {'manufacturer': u'CreeLED, Inc.'}; Package: None; Price: None; Value: *; MP: CLMVC-FKA-CL1D1L71BB7C3C3; Availability: Unavailable
Q1-Q3 = CMP-0630-00210-1: Digital Transistor (BRT), R1=10 kOhm, R2=10 kOhm, NPN Transistor, 3-Pin SC-75, Pb-Free, Tape and Reel; Manufacturer: On Semiconductor; IC Continuous (A): 0.1; hFE Min: 35; V(BR)CEO Min (V): 50; R1/R2 Typ: 1; Mounting Technology: Surface Mount; RoHS: TRUE; Packing: Tape and Reel; DatasheetVersion: Rev. 5; ComponentLink1Description: Manufacturer URL; ComponentLink3Description: Package Specification; PartNumber: DTC114EET1G; PackageReference: SC-75-3-463-01; PackageVersion: Rev. F, 07/2005; ComponentLink1URL: http://www.onsemi.com/; Polarity: NPN; ComponentLink3URL: http://www.onsemi.com/pub_link/Collateral/463-01.PDF; ComponentLink2Description: Datasheet; PackageDescription: 3-Pin Small Outline Transistor, Body 1.6 x 0.8 mm, Pitch 0.5 mm; ComponentLink2URL: http://www.onsemi.cn/pub_link/Collateral/DTC114E-D.PDF
R10-R12 = 0402 SMD Resistor: as R23 on sheet ICDI; ComponentLink1Description: Link; ComponentLink1URL: *; Supplier: Digikey; Supplier Part Number: 541-RCC0402330RFKEDCT-ND; RoHS: Yes; Category: Chip SMD Resistors; Stock: 92625; Pricing: 1=0.1, 10=0.046, 50=0.0296, 100=0.0248, 500=0.01724, 1000=0.01499, 5000=0.0113 (USD)
SW1 SW2 = B3S-1000: Tactile Switch SPST-NO Top Actuated Surface Mount; pin to pad: 2>1+2 4>3+4; MF: Omron; Availability: Unavailable; Value: *; Package: None; Price: None; MP: B3S-1000; SnapEDA_Link: https://www.snapeda.com/parts/B3S-1000/Omron%20Electronics%20Inc-EMC%20Div/view-part/47351/?ref=snap

## Sheet Powering.SchDoc
size B; SheetNumber: 5; SheetTotal: 6
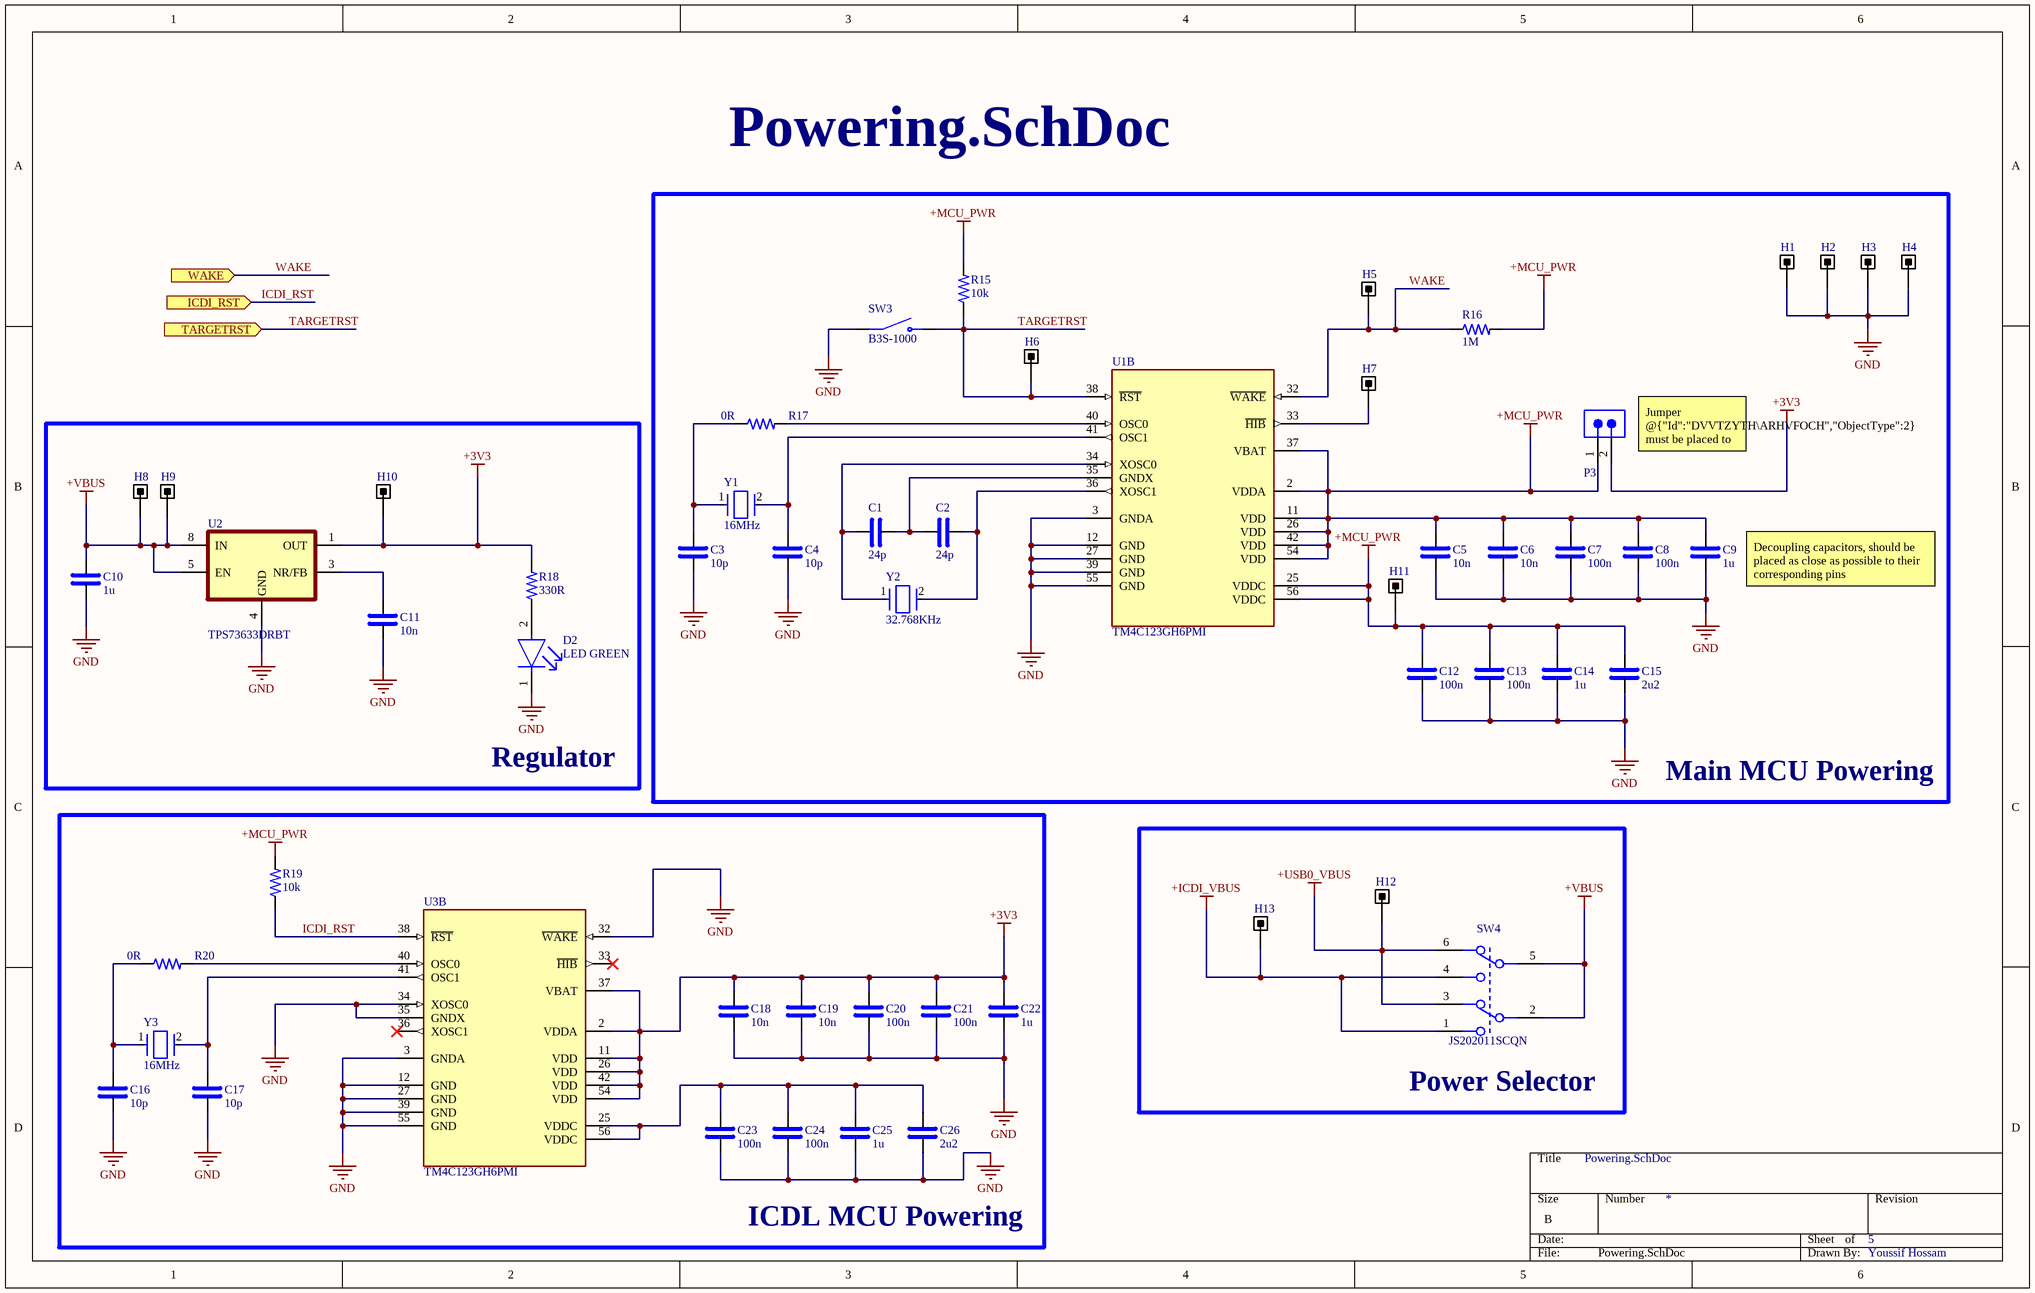
[diagram p5: Powering.SchDoc]

### Parts
C1  24p  [0402 CAP]
C2  24p  [0402 CAP]
C3  10p  [0402 CAP]
C4  10p  [0402 CAP]
C5  10n  [0402 CAP]
C6  10n  [0402 CAP]
C7  100n  [0402 CAP]
C8  100n  [0402 CAP]
C9  1u  [0402 CAP]
C10  1u  [0402 CAP]
C11  10n  [0402 CAP]
C12  100n  [0402 CAP]
C13  100n  [0402 CAP]
C14  1u  [0402 CAP]
C15  2u2  [FP-GCJ188-0_2-IPC_C]
C16  10p  [0402 CAP]
C17  10p  [0402 CAP]
C18  10n  [0402 CAP]
C19  10n  [0402 CAP]
C20  100n  [0402 CAP]
C21  100n  [0402 CAP]
C22  1u  [0402 CAP]
C23  100n  [0402 CAP]
C24  100n  [0402 CAP]
C25  1u  [0402 CAP]
C26  2u2  [FP-GCJ188-0_2-IPC_C]
D2  LED GREEN  [FP-LTST-C171GKT-MFG]
H1  Test Point  [Test Point]  (value not drawn)
H2  Test Point  [Test Point]  (value not drawn)
H3  Test Point  [Test Point]  (value not drawn)
H4  Test Point  [Test Point]  (value not drawn)
H5  Test Point  [Test Point]  (value not drawn)
H6  Test Point  [Test Point]  (value not drawn)
H7  Test Point  [Test Point]  (value not drawn)
H8  Test Point  [Test Point]  (value not drawn)
H9  Test Point  [Test Point]  (value not drawn)
H10  Test Point  [Test Point]  (value not drawn)
H11  Test Point  [Test Point]  (value not drawn)
H12  Test Point  [Test Point]  (value not drawn)
H13  Test Point  [Test Point]  (value not drawn)
P3  61300211121  [61300211121]  (value not drawn)
R15  10k  [0402 RES]
R16  1M  [0402 RES]
R17  0R  [FP-ERA3A-IPC_B]
R18  330R  [0402 RES]
R19  10k  [0402 RES]
R20  0R  [FP-ERA3A-IPC_B]
SW3  B3S-1000  [SW_B3S-1000]
SW4  JS202011SCQN  [FP-JS202011SCQN-MFG]
U1  TM4C123GH6PMI  [QFP50P1200X1200X160-64N]  (part B of 2)
U2  TPS73633DRBT  [IC_DRV8601DRBT]
U3  TM4C123GH6PMI  [QFP50P1200X1200X160-64N]  (part B of 2)
Y1  16MHz  [FP-ABM3-MFG]
Y2  32.768KHz  [FP-AB26TRB-MFG]
Y3  16MHz  [FP-ABM3-MFG]

### Blocks framed on the sheet
Main MCU Powering: C1-C9 C12-C15 H1-H7 H11 P3 R15-R17 SW3 U1 Y1 Y2
Regulator: C10 C11 D2 H8-H10 R18 U2
ICDL MCU Powering: C16-C26 R19 R20 U3 Y3
Power Selector: H12 H13 SW4

### Ports
ICDI_RST (in, see Master[4B], Connectors[6A]), TARGETRST (in, see Master[4B], Connectors[6B], In-Circuit_Debug_Interface[1A]), WAKE (in, see Master[4B], LEDS_SWITCHS[4B])

### Nets
+3V3: C18.2 C19.2 C20.2 C21.2 C22.2 H10.1 P3.2 R18.2 U2.1(OUT) U3.2(VDDA) U3.11(VDD) U3.26(VDD) U3.37(VBAT) U3.42(VDD) U3.54(VDD)
+ICDI_VBUS: H13.1 SW4.1 SW4.4
+MCU_PWR: C5.2 C6.2 C7.2 C8.2 C9.2 C12.2 C13.2 C14.2 C15.2 H11.1 P3.1 R15.2 R16.2 R19.2 U1.2(VDDA) U1.11(VDD) U1.25(VDDC) U1.26(VDD) U1.37(VBAT) U1.42(VDD) U1.54(VDD) U1.56(VDDC)
+USB0_VBUS: H12.1 SW4.3 SW4.6
+VBUS: C10.2 H8.1 H9.1 SW4.2 SW4.5 U2.5(EN) U2.8(IN)
GND: C3.1 C4.1 C5.1 C6.1 C7.1 C8.1 C9.1 C10.1 C11.1 C12.1 C13.1 C14.1 C15.1 C16.1 C17.1 C18.1 C19.1 C20.1 C21.1 C22.1 C23.1 C24.1 C25.1 C26.1 D2.1(C) H1.1 H2.1 H3.1 H4.1 SW3.2(COM) U1.3(GNDA) U1.12(GND) U1.27(GND) U1.39(GND) U1.55(GND) U2.4(GND) U3.3(GNDA) U3.12(GND) U3.27(GND) U3.32(~{WAKE}) U3.34(XOSC0) U3.35(GNDX) U3.39(GND) U3.55(GND)
ICDI_RST: R19.1 U3.38(~{RST}) ; port ICDI_RST
TARGETRST: H6.1 R15.1 SW3.4(NO) U1.38(~{RST}) ; port TARGETRST
WAKE: H5.1 R16.1 U1.32(~{WAKE}) ; port WAKE  [project net USR_SW2]
NetC1_1: C1.1 C2.2 U1.35(GNDX)
NetC1_2: C1.2 U1.34(XOSC0) Y2.1
NetC2_1: C2.1 U1.36(XOSC1) Y2.2
NetC3_2: C3.2 R17.1 Y1.1
NetC4_2: C4.2 U1.41(OSC1) Y1.2
NetC11_2: C11.2 U2.3(NR/FB)
NetC16_2: C16.2 R20.1 Y3.1
NetC17_2: C17.2 U3.41(OSC1) Y3.2
NetC23_2: C23.2 C24.2 C25.2 C26.2 U3.25(VDDC) U3.56(VDDC)
NetD2_2: D2.2(A) R18.1
NetH7_1: H7.1 U1.33(~{HIB})
NetR17_2: R17.2 U1.40(OSC0)
NetR20_2: R20.2 U3.40(OSC0)

Not connected (* = marked no-connect by the designer): U3 33(~{HIB})* 36(XOSC1)*

### Notes on the sheet
- (near P3) Jumper @{"Id":"DVVTZYTH\ARHVFOCH","ObjectType":2} must be placed to power the MCU.
- (near C9) Decoupling capacitors, should be placed as close as possible to their corresponding pins

### Library data of the parts
C1 C2 = 0402 SMD Capacitor: 24 pF ±5% 50V Ceramic Capacitor C0G, NP0 0402 (1005 Metric); Part Number: C1005C0G1H240J; Capacitance: 10pF; Voltage: 50V; ComponentLink1Description: Link; ComponentLink1URL: *
C3 C4 C16 C17 = 0402 SMD Capacitor: 10 pF ±5% 50V Ceramic Capacitor C0G, NP0 0402 (1005 Metric); Part Number: GRM1555C1H100JZ01D; Capacitance: 10pF; Voltage: 50V; ComponentLink1Description: Link; ComponentLink1URL: *
C5 C6 C11 C18 C19 = 0402 SMD Capacitor: Ceramic Capacitor, Multilayer, Ceramic, 25V, 10% +Tol, 10% -Tol, X7R, 15% TC, 0.01uF, Surface Mount, 0402; Manufacturer: Taiyo Yuden; Manufacturer Part Number: TMK105B7103KV-F; Value: 10nF; Multilayer: Yes; ComponentLink1Description: Link; ComponentLink1URL: *; Supplier Part Number: TMK105B7103KV-F; RoHS: Yes; Category: Ceramic Capacitors; Stock: 90000; Pricing: 10000=0.00213 (USD); Mounting Technology: Surface Mount; Pins: 2; Dielectric Material: Ceramic; Package Shape: Rectangular; Case/Package: 0402; Terminal Finish: Tin; Min Operating Temperature: -55°C; Max Operating Temperature: 125°C; JESD-609 Code: e3; Capacitor Type: Ceramic; Tolerance  (fill in as +-): 10%; Package Style: SMTMeter; Packaging: Tape and Reel; Tolerance (fill in as +-): 10%; Rated DC Voltage (URdc): 25V; Temperature Characteristics Code: X7R; Termination: Wraparound; Length: 1mm; Width: 0.5mm; Height: 0.5mm; Reach SVHC Compliant: Yes; RoHS Compliant: Yes; ComponentLink2URL: https://datasheet.ciiva.com:443/pdfs/VipMasterIC/IC/TAIY/TAIY-S-A0007936089/TAIY-S-A0007936093-1.pdf?src-supplier=IHS+Markit; ComponentLink2Description: https://datasheet.ciiva.com:443/pdfs/VipMasterIC/IC/TAIY/TAIY-S-A0007936089/TAIY-S-A0007936093-1.pdf?src-supplier=IHS+Markit; ComponentLink3URL: https://datasheet.ciiva.com/129/tmk105b7103kv-f-ss-129699.pdf?src-supplier=Digikey; ComponentLink3Description: https://datasheet.ciiva.com/129/tmk105b7103kv-f-ss-129699.pdf?src-supplier=Digikey; ComponentLink4URL: https://datasheet.ciiva.com/15922/204tmk105b7103kv-f-15922348.pdf?src-supplier=Onlinecomponents.com; ComponentLink4Description: https://datasheet.ciiva.com/15922/204tmk105b7103kv-f-15922348.pdf?src-supplier=Onlinecomponents.com; ComponentLink5URL: https://datasheet.ciiva.com/30156/190tmk105b7103kv-f-30156174.pdf?src-supplier=Onlinecomponents.com; ComponentLink5Description: https://datasheet.ciiva.com/30156/190tmk105b7103kv-f-30156174.pdf?src-supplier=Onlinecomponents.com; ComponentLink6URL: https://datasheet.ciiva.com/7975/746258-7975835.pdf?src-supplier=Element14; ComponentLink6Description: https://datasheet.ciiva.com/7975/746258-7975835.pdf?src-supplier=Element14
C7 C8 C12 C13 C20 C21 C23 C24 = 0402 SMD Capacitor: Ceramic Capacitor, Multilayer, Ceramic, 16V, 10% +Tol, 10% -Tol, X7R, 15% TC, 0.1uF, Surface Mount, 0402; Manufacturer: Taiyo Yuden; Manufacturer Part Number: EMK105B7104KV-F; Value: 100nF; Multilayer: Yes; ComponentLink1Description: Link; ComponentLink1URL: *; Supplier: Avnet; Supplier Part Number: EMK105B7104KV-F; RoHS: Yes; Category: Ceramic Capacitors; Stock: 830000; Pricing: 10000=0.00238 (USD); Mounting Technology: Surface Mount; Pins: 2; Dielectric Material: Ceramic; Package Shape: Rectangular; Case/Package: 0402; Terminal Finish: Nickel; Min Operating Temperature: -55°C; Max Operating Temperature: 125°C; JESD-609 Code: e3; Capacitor Type: Ceramic; Tolerance  (fill in as +-): 10%; Package Style: SMTMeter; Packaging: Tape and Reel; Tolerance (fill in as +-): 10%; Rated DC Voltage (URdc): 16V; Temperature Characteristics Code: X7R; Termination: Wraparound; Length: 1mm; Width: 0.5mm; Height: 0.5mm; Reach SVHC Compliant: Yes; RoHS Compliant: Yes; ComponentLink2URL: https://datasheet.ciiva.com:443/pdfs/VipMasterIC/IC/TAIY/TAIY-S-A0009096450/TAIY-S-A0009096704-1.pdf?src-supplier=IHS+Markit; ComponentLink2Description: https://datasheet.ciiva.com:443/pdfs/VipMasterIC/IC/TAIY/TAIY-S-A0009096450/TAIY-S-A0009096704-1.pdf?src-supplier=IHS+Markit
C9 C10 C14 C22 C25 = 0402 SMD Capacitor: Ceramic Capacitor, Ceramic, 10V, 10% +Tol, 10% -Tol, X5R, 15% TC, 1uF, Surface Mount, 0402; Manufacturer: Johanson; Manufacturer Part Number: 100R07X105KV4T; Multilayer: Yes; ComponentLink1Description: Link; ComponentLink1URL: *; Supplier: Mouser; Supplier Part Number: 605-100R07X105KV4T; RoHS: Yes; Category: Ceramic Capacitors; Stock: 57414; Pricing: 1=0.26, 10=0.169, 50=0.169, 100=0.086, 1000=0.055, 10000=0.042 (USD); Mounting Technology: Surface Mount; Pins: 2; Dielectric Material: Ceramic; Package Shape: Rectangular; Case/Package: 0402; Terminal Finish: Nickel; Min Operating Temperature: -55°C; Max Operating Temperature: 85°C; JESD-609 Code: e3; Value: 1uF; Capacitor Type: Ceramic; Tolerance  (fill in as +-): 10%; Package Style: SMTMeter; Packaging: Tape and Reel; Tolerance (fill in as +-): 10%; Rated DC Voltage (URdc): 10V; Temperature Characteristics Code: X5R; Termination: Wraparound; Length: 1.02mm; Width: 0.51mm; Height: 0.64mm; Reach SVHC Compliant: Yes; RoHS Compliant: Yes; ComponentLink2URL: https://datasheet.ciiva.com:443/pdfs/VipMasterIC/IC/JOHA/JOHA-S-A0008489419/JOHA-S-A0008489419-1.pdf?src-supplier=IHS+Markit; ComponentLink2Description: https://datasheet.ciiva.com:443/pdfs/VipMasterIC/IC/JOHA/JOHA-S-A0008489419/JOHA-S-A0008489419-1.pdf?src-supplier=IHS+Markit; ComponentLink3URL: https://datasheet.ciiva.com/22693/jdi-full-catalog-2012-01-22693744.pdf?src-supplier=Element14; ComponentLink3Description: https://datasheet.ciiva.com/22693/jdi-full-catalog-2012-01-22693744.pdf?src-supplier=Element14; ComponentLink4URL: https://datasheet.ciiva.com/26948/getdatasheetpartid-789067-26948543.pdf?src-supplier=Verical; ComponentLink4Description: https://datasheet.ciiva.com/26948/getdatasheetpartid-789067-26948543.pdf?src-supplier=Verical
C15 C26 = 0603 SMD CAP: Ceramic Capacitor, Multilayer, Ceramic, 16V, 10% +Tol, 10% -Tol, X5R, 15% TC, 2.2uF, Surface Mount, 0603; Manufacturer: Murata; Manufacturer Part Number: GRM188R61C225KE15D; Multilayer: Yes; Supplier: Arrow Electronics; Supplier Part Number: GRM188R61C225KE15D; RoHS: Yes; Category: Ceramic Capacitors; Stock: 88000; Pricing: 8000=0.0127, 12000=0.012, 20000=0.0118, 24000=0.0111, 100000=0.0106 (USD); Mounting Technology: Surface Mount; Pins: 2; Dielectric Material: Ceramic; Package Shape: Rectangular; Case/Package: 0603; Terminal Finish: Nickel; Min Operating Temperature: -55°C; Max Operating Temperature: 85°C; JESD-609 Code: e3; Value: 2.2uF; Capacitor Type: Ceramic; Tolerance  (fill in as +-): 10%; Package Style: SMTMeter; Packaging: Tape and Reel; Tolerance (fill in as +-): 10%; Rated DC Voltage (URdc): 16V; Temperature Characteristics Code: X5R; Termination: Wraparound; Length: 1.6mm; Width: 0.8mm; Height: 0.8mm; Reach SVHC Compliant: Yes; RoHS Compliant: Yes; ComponentLink1URL: https://datasheet.ciiva.com:443/pdfs/VipMasterIC/IC/MURE/MURE-S-A0004349797/MURE-S-A0004352668-1.pdf?src-supplier=IHS+Markit; ComponentLink1Description: https://datasheet.ciiva.com:443/pdfs/VipMasterIC/IC/MURE/MURE-S-A0004349797/MURE-S-A0004352668-1.pdf?src-supplier=IHS+Markit; ComponentLink2URL: https://datasheet.ciiva.com/135/grm188r61c225ke15-01-135062.pdf?src-supplier=Digikey; ComponentLink2Description: https://datasheet.ciiva.com/135/grm188r61c225ke15-01-135062.pdf?src-supplier=Digikey; ComponentLink3URL: https://datasheet.ciiva.com/135/grm188r61c225ke15-01-135063.pdf?src-supplier=Digikey; ComponentLink3Description: https://datasheet.ciiva.com/135/grm188r61c225ke15-01-135063.pdf?src-supplier=Digikey; ComponentLink4URL: https://datasheet.ciiva.com/5417/product-5417088.pdf?src-supplier=Mouser; ComponentLink4Description: https://datasheet.ciiva.com/5417/product-5417088.pdf?src-supplier=Mouser; ComponentLink5URL: https://datasheet.ciiva.com/3777/147grm188r61c225ke1523-3777042.pdf?src-supplier=Arrow+Electronics; ComponentLink5Description: https://datasheet.ciiva.com/3777/147grm188r61c225ke1523-3777042.pdf?src-supplier=Arrow+Electronics; ComponentLink6URL: https://datasheet.ciiva.com/29199/454457-da-01-en-vs-kondensator-0603-29199689.pdf?src-supplier=Conrad; ComponentLink6Description: https://datasheet.ciiva.com/29199/454457-da-01-en-vs-kondensator-0603-29199689.pdf?src-supplier=Conrad; ComponentLink7URL: https://datasheet.ciiva.com/135/grm188r61c225ke15-01-135061.pdf?src-supplier=Digikey; ComponentLink7Description: https://datasheet.ciiva.com/135/grm188r61c225ke15-01-135061.pdf?src-supplier=Digikey; ComponentLink8URL: https://datasheet.ciiva.com/16369/product-16369274.pdf?src-supplier=Future+Electronics; ComponentLink8Description: https://datasheet.ciiva.com/16369/product-16369274.pdf?src-supplier=Future+Electronics
D2 = CMP-22017-000007-1: LED GREEN CLEAR CHIP SMD; Luminous Intensity: 12mcd; Lens Color: Colorless; Dominant Wavelength: 569nm; Number of LEDs: 1; Power Dissipation: 100mW; Viewing Angle: 130°; Reverse Voltage: 5V; Test Current: 10mA; Forward Voltage: 2.1V; Wavelength: 585nm; Lens Style: Diffused; Forward Current: 30mA; Height: 0.8mm; Mount: Surface Mount; Package Quantity: 1; Length: 2mm; Case Code (Metric): 2012; Number of Pins: 2; Number of Elements: 1; Packaging: Tape and Reel; Color: Green; Min Operating Temperature: -55°C; Case/Package: 0805; Power Rating: 100mW; Max Operating Temperature: 85°C; Radiation Hardening: No; Depth: 1.25mm; Lens Transparency: Clear; Width: 1.25mm; Lead Free: Lead Free; Case Code (Imperial): 0805; Illumination Color: Green
P3 = 61300211121: WR-PHD Pin Header, THT, Vertical, pitch 2.54mm, 1 Row, 2P; Manufacturer: Wurth Elektronik; Contact Resistance: 20mOhm; Rated Current: 3A; Working Voltage: 250V; Withstanding Voltage: 500V; Manufacturer Part Number: 61300211121; Category: Board-to-Board Connectors; Match Code: WR-PHD; ComponentLink1Description: Website Link; ComponentLink1URL: https://www.we-online.com/redexpert/article/61300211121?ad; ComponentLink2Description: Datasheet Link; ComponentLink2URL: https://www.we-online.com/redexpert/spec/61300211121?ad; Mount: Through Hole; Operating Temperature Max: 105°C; Operating Temperature Min: -40°C; Packaging: Bag; Gender: Pin Header; Number of Pins: 2; Number of Rows: 1; Orientation: Vertical; Pitch: 2.54mm
R15 R19 = 0402 SMD Resistor: as R21 on sheet ICDI; ComponentLink1Description: Link; ComponentLink1URL: *; Supplier: Future Electronics; Supplier Part Number: 3388022; RoHS: Yes; Category: Chip SMD Resistors; Stock: 31210000; Pricing: 10000=0.0016, 100000=0.0015, 300000=0.0015, 1250000=0.0014, 3000000=0.0013 (USD); Mounting Technology: Surface Mount; Pins: 2; Package Shape: Rectangular; Case/Package: 0402; Terminal Finish: Nickel; Min Operating Temperature: -55°C; Max Operating Temperature: 155°C; JESD-609 Code: e3; Termination: Wraparound; Resistor Type: FIXED RESISTOR; Construction: Chip; Packaging: Tape and Reel; Technology: METAL GLAZE/THICK FILM; Working Voltage: 50V; Reach SVHC Compliant: Yes; RoHS Compliant: Yes; ComponentLink2URL: https://datasheet.ciiva.com:443/pdfs/VipMasterIC/IC/YAGO/YAGO-S-A0008145938/YAGO-S-A0008145938-1.pdf?src-supplier=IHS+Markit; ComponentLink2Description: https://datasheet.ciiva.com:443/pdfs/VipMasterIC/IC/YAGO/YAGO-S-A0008145938/YAGO-S-A0008145938-1.pdf?src-supplier=IHS+Markit
R16 = 0402 SMD Resistor: 1 MOhms ±1% 0.063W, 1/16W Chip Resistor 0402 (1005 Metric) Thick Film; Part Number: MCR01MRTF1004; Resistance: 1M; ComponentLink1Description: Link; ComponentLink1URL: *; Tolerance: ±1%; Wattage: 1/16W
R17 R20 = 0603 SMD RES: as R1 on sheet Main_MCU; Supplier: Mouser; Supplier Part Number: 667-ERJ-3GEY0R00V; RoHS: Yes; Category: Chip SMD Resistors; Stock: 3258844; Pricing: 1=0.1, 10=0.022, 50=0.022, 100=0.01, 1000=0.008, 10000=0.004 (USD); Mounting Technology: Surface Mount; Pins: 2; Package Shape: Rectangular; Case/Package: 0603; Terminal Finish: Nickel; Min Operating Temperature: -55°C; Max Operating Temperature: 155°C; JESD-609 Code: e3; Resistor Type: FIXED RESISTOR; Construction: Rectangular; Packaging: Tape and Reel; Value: 0R; Technology: METAL GLAZE/THICK FILM; Termination: Wraparound; Reach SVHC Compliant: Yes; RoHS Compliant: Yes; ComponentLink1URL: https://datasheet.ciiva.com:443/pdfs/VipMasterIC/IC/PANA/PANA-S-A0009459603/PANA-S-A0009459603-1.pdf?src-supplier=IHS+Markit; ComponentLink1Description: https://datasheet.ciiva.com:443/pdfs/VipMasterIC/IC/PANA/PANA-S-A0009459603/PANA-S-A0009459603-1.pdf?src-supplier=IHS+Markit; ComponentLink2URL: https://datasheet.ciiva.com/27055/1935748-27055113.pdf?src-supplier=Jameco; ComponentLink2Description: https://datasheet.ciiva.com/27055/1935748-27055113.pdf?src-supplier=Jameco; ComponentLink3URL: https://datasheet.ciiva.com/11808/0900766b80f806dd-11808207.pdf?src-supplier=Rs; ComponentLink3Description: https://datasheet.ciiva.com/11808/0900766b80f806dd-11808207.pdf?src-supplier=Rs; ComponentLink4URL: https://datasheet.ciiva.com/46377/1678796-46377868.pdf?src-supplier=Element14; ComponentLink4Description: https://datasheet.ciiva.com/46377/1678796-46377868.pdf?src-supplier=Element14; ComponentLink5URL: https://datasheet.ciiva.com/9198/aoa0000ce1-9198975.pdf?src-supplier=Avnet; ComponentLink5Description: https://datasheet.ciiva.com/9198/aoa0000ce1-9198975.pdf?src-supplier=Avnet; ComponentLink6URL: https://datasheet.ciiva.com/16834/aoa0000ce1-16834828.pdf?src-supplier=Future+Electronics; ComponentLink6Description: https://datasheet.ciiva.com/16834/aoa0000ce1-16834828.pdf?src-supplier=Future+Electronics; ComponentLink7URL: https://datasheet.ciiva.com/30199/4aoa0000ce1-30199822.pdf?src-supplier=Onlinecomponents.com; ComponentLink7Description: https://datasheet.ciiva.com/30199/4aoa0000ce1-30199822.pdf?src-supplier=Onlinecomponents.com; ComponentLink8URL: https://datasheet.ciiva.com/43460/1678796-43460647.pdf?src-supplier=Farnell; ComponentLink8Description: https://datasheet.ciiva.com/43460/1678796-43460647.pdf?src-supplier=Farnell; ComponentLink9URL: https://datasheet.ciiva.com/5959/1678796-5959707.pdf?src-supplier=Farnell; ComponentLink9Description: https://datasheet.ciiva.com/5959/1678796-5959707.pdf?src-supplier=Farnell; ComponentLink10URL: https://datasheet.ciiva.com/28695/1678796-28695833.pdf?src-supplier=Element14; ComponentLink10Description: https://datasheet.ciiva.com/28695/1678796-28695833.pdf?src-supplier=Element14; ComponentLink11URL: https://datasheet.ciiva.com/16758/70255313-16758527.pdf?src-supplier=Allied+Electronics; ComponentLink11Description: https://datasheet.ciiva.com/16758/70255313-16758527.pdf?src-supplier=Allied+Electronics; ComponentLink12URL: https://datasheet.ciiva.com/48532/aoa0000ce1-48532165.pdf?src-supplier=Avnet; ComponentLink12Description: https://datasheet.ciiva.com/48532/aoa0000ce1-48532165.pdf?src-supplier=Avnet
R18 = 0402 SMD Resistor: as R23 on sheet ICDI; ComponentLink1Description: Link; ComponentLink1URL: *; Supplier: Digikey; Supplier Part Number: 541-RCC0402330RFKEDCT-ND; RoHS: Yes; Category: Chip SMD Resistors; Stock: 92625; Pricing: 1=0.1, 10=0.046, 50=0.0296, 100=0.0248, 500=0.01724, 1000=0.01499, 5000=0.0113 (USD)
SW3 = B3S-1000: Tactile Switch SPST-NO Top Actuated Surface Mount; pin to pad: 2>1+2 4>3+4; MF: Omron; Availability: Unavailable; Value: *; Package: None; Price: None; MP: B3S-1000; SnapEDA_Link: https://www.snapeda.com/parts/B3S-1000/Omron%20Electronics%20Inc-EMC%20Div/view-part/47351/?ref=snap
SW4 = CMP-2000-05087-3: SWITCH SLIDE DPDT 300MA 6V; Switch Function: On-On; Actuator Type: Standard; Switch Travel: 2mm; Actuator Color: Black; Contact Resistance: 70mR; Electrical Life: 5000Cycles; Actuator Material: Nylon; REACH SVHC: No SVHC; Series: JS; Min Operating Temperature: -20°C; Depth: 7.5mm; Housing Material: Nylon; Voltage Rating (DC): 6V; Max Operating Temperature: 85°C; Contact Current Rating: 300mA; Package Quantity: 1; Contact Plating: Silver; Contact Material: Copper Alloy; Throw Configuration: DPDT; Current Rating: 300mA; Orientation: Vertical; Max Current Rating: 300mA; Max Voltage Rating (DC): 6V; Flammability Rating: UL94 V-2; Length: 9mm; Packaging: Tape and Reel; Mount: Surface Mount; Actuator Length: 2mm; Lead Free: Lead Free; Termination: Gull Wing; Radiation Hardening: No
U1 U3 = TM4C123GH6PMI: as U1 on sheet Main_MCU; Price: None; Availability: Unavailable; SnapEDA_Link: https://www.snapeda.com/parts/TM4C123GH6PMI/Texas%20Instruments/view-part/557012/?ref=snap; Value: *; Package: LQFP-64 Texas Instruments; MP: TM4C123GH6PMI
Y1 Y3 = CMP-27762-013555-1: Crystal 16MHz ±20ppm 18pF SMD-2 5mm x 3.2mm; ESR (Equivalent Series Resistance): 40R; Frequency Stability: 50ppm; Series Resistance: 60R; Frequency Tolerance: 20ppm; Min Operating Temperature: -20°C; Frequency: 16MHz; Max Operating Temperature: 70°C; Depth: 3.2mm; Length: 5mm; Height: 0.051inch; Mount: Surface Mount; Resistor Type: Ceramic; Package Quantity: 1000; Number of Pins: 2; Width: 3.2mm; Case/Package: CSMD; Tolerance: 20ppm; Series: ABM3; Termination: SMD/SMT; Accuracy: 20ppm; REACH SVHC: Yes; Load Capacitance: 18pF; Operating Frequency: 16 MHz; Lead Free: Lead Free; Packaging: Tape and Reel
Y2 = CMP-27762-006068-1: CRYSTAL 32.7680KHZ 12.5PF TH; Frequency Stability: -0.034ppm; Frequency Tolerance: 20ppm; Series Resistance: 50kR; Case/Package: Radial; Package Quantity: 500; Packaging: Tape and Reel; Lead Pitch: 2.54mm; Termination: Radial; Mount: Surface Mount; Frequency: 32.768kHz; Min Operating Temperature: -40°C; REACH SVHC: No SVHC; Load Capacitance: 12.5pF; Lead Free: Lead Free; Operating Frequency: 32.768 kHz; Max Operating Temperature: 85°C; Length: 6mm; Height: 0.075inch; Depth: 1.9mm; Tolerance: 20ppm; ESR (Equivalent Series Resistance): 50kR; Number of Pins: 2; Series: AB26TRB
U2 = TPS73633DRBT: Package: None; Price: None; Value: *; MP: TPS73633DRBT; Availability: Unavailable